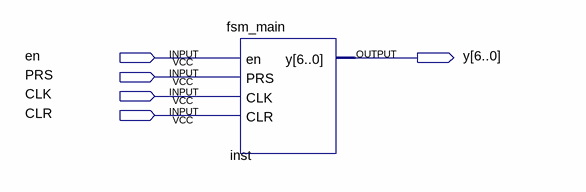
[diagram p0: schematic sheet]
// Quartus schematic test02.bdf as structural Verilog: 1 symbols, 5 pins
module test02 (
  input  en,
  input  PRS,
  input  CLK,
  input  CLR,
  output [6:0] y
);

  fsm_main inst (.en(en), .PRS(PRS), .CLK(CLK), .CLR(CLR), .y(y));
endmodule
